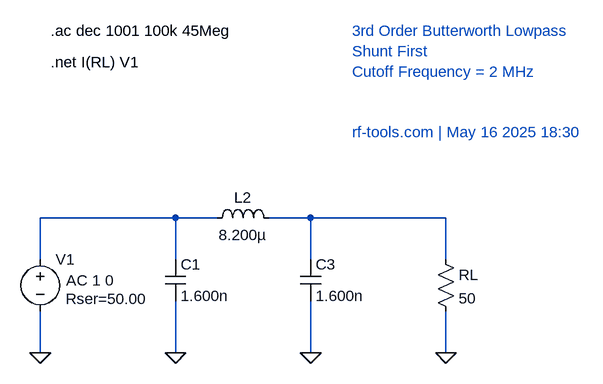
[diagram p0: schematic BP_1.asc]
BP_1.asc, the LTspice schematic file:
Version 4
SHEET 1 1200 400
WIRE 208 0 0 0
WIRE 272 0 208 0
WIRE 416 0 352 0
WIRE 624 0 416 0
WIRE 0 64 0 0
WIRE 208 64 208 0
WIRE 416 64 416 0
WIRE 624 64 624 0
WIRE 0 208 0 144
WIRE 208 208 208 128
WIRE 416 208 416 128
WIRE 624 208 624 144
FLAG 0 208 0
FLAG 208 208 0
FLAG 416 208 0
FLAG 624 208 0
SYMBOL voltage 0 48 R0
WINDOW 123 40 48 Left 2
WINDOW 39 39 77 Left 2
SYMATTR Value2 AC 1 0
SYMATTR SpiceLine Rser=50.00
SYMATTR InstName V1
SYMATTR Value ""
SYMBOL cap 192 64 R0
SYMATTR InstName C1
SYMATTR Value 1.600n
SYMBOL ind 256 16 R270
WINDOW 0 32 56 VTop 2
WINDOW 3 5 56 VBottom 2
SYMATTR InstName L2
SYMATTR Value 8.200µ
SYMBOL cap 400 64 R0
SYMATTR InstName C3
SYMATTR Value 1.600n
SYMBOL res 608 48 R0
SYMATTR InstName RL
SYMATTR Value 50
TEXT 16 -288 Left 2 !.ac dec 1001 100k 45Meg
TEXT 16 -240 Left 2 !.net I(RL) V1
TEXT 480 -288 Left 2 ;3rd Order Butterworth Lowpass\nShunt First\nCutoff Frequency = 2 MHz\n\n\nrf-tools.com | May 16 2025 18:30

The netlist it stands for:
* BP_1.asc
V1 N001 0 AC 1 0 Rser=50.00
C1 N001 0 1.600n
L2 N001 N002 8.200µ
C3 N002 0 1.600n
RL N002 0 50
.ac dec 1001 100k 45Meg
.net I(RL) V1
* 3rd Order Butterworth Lowpass
* Shunt First
* Cutoff Frequency = 2 MHz
* rf-tools.com | May 16 2025 18:30
.backanno
.end